# EAGLE design puck_lights (EAGLE 8.6.0)
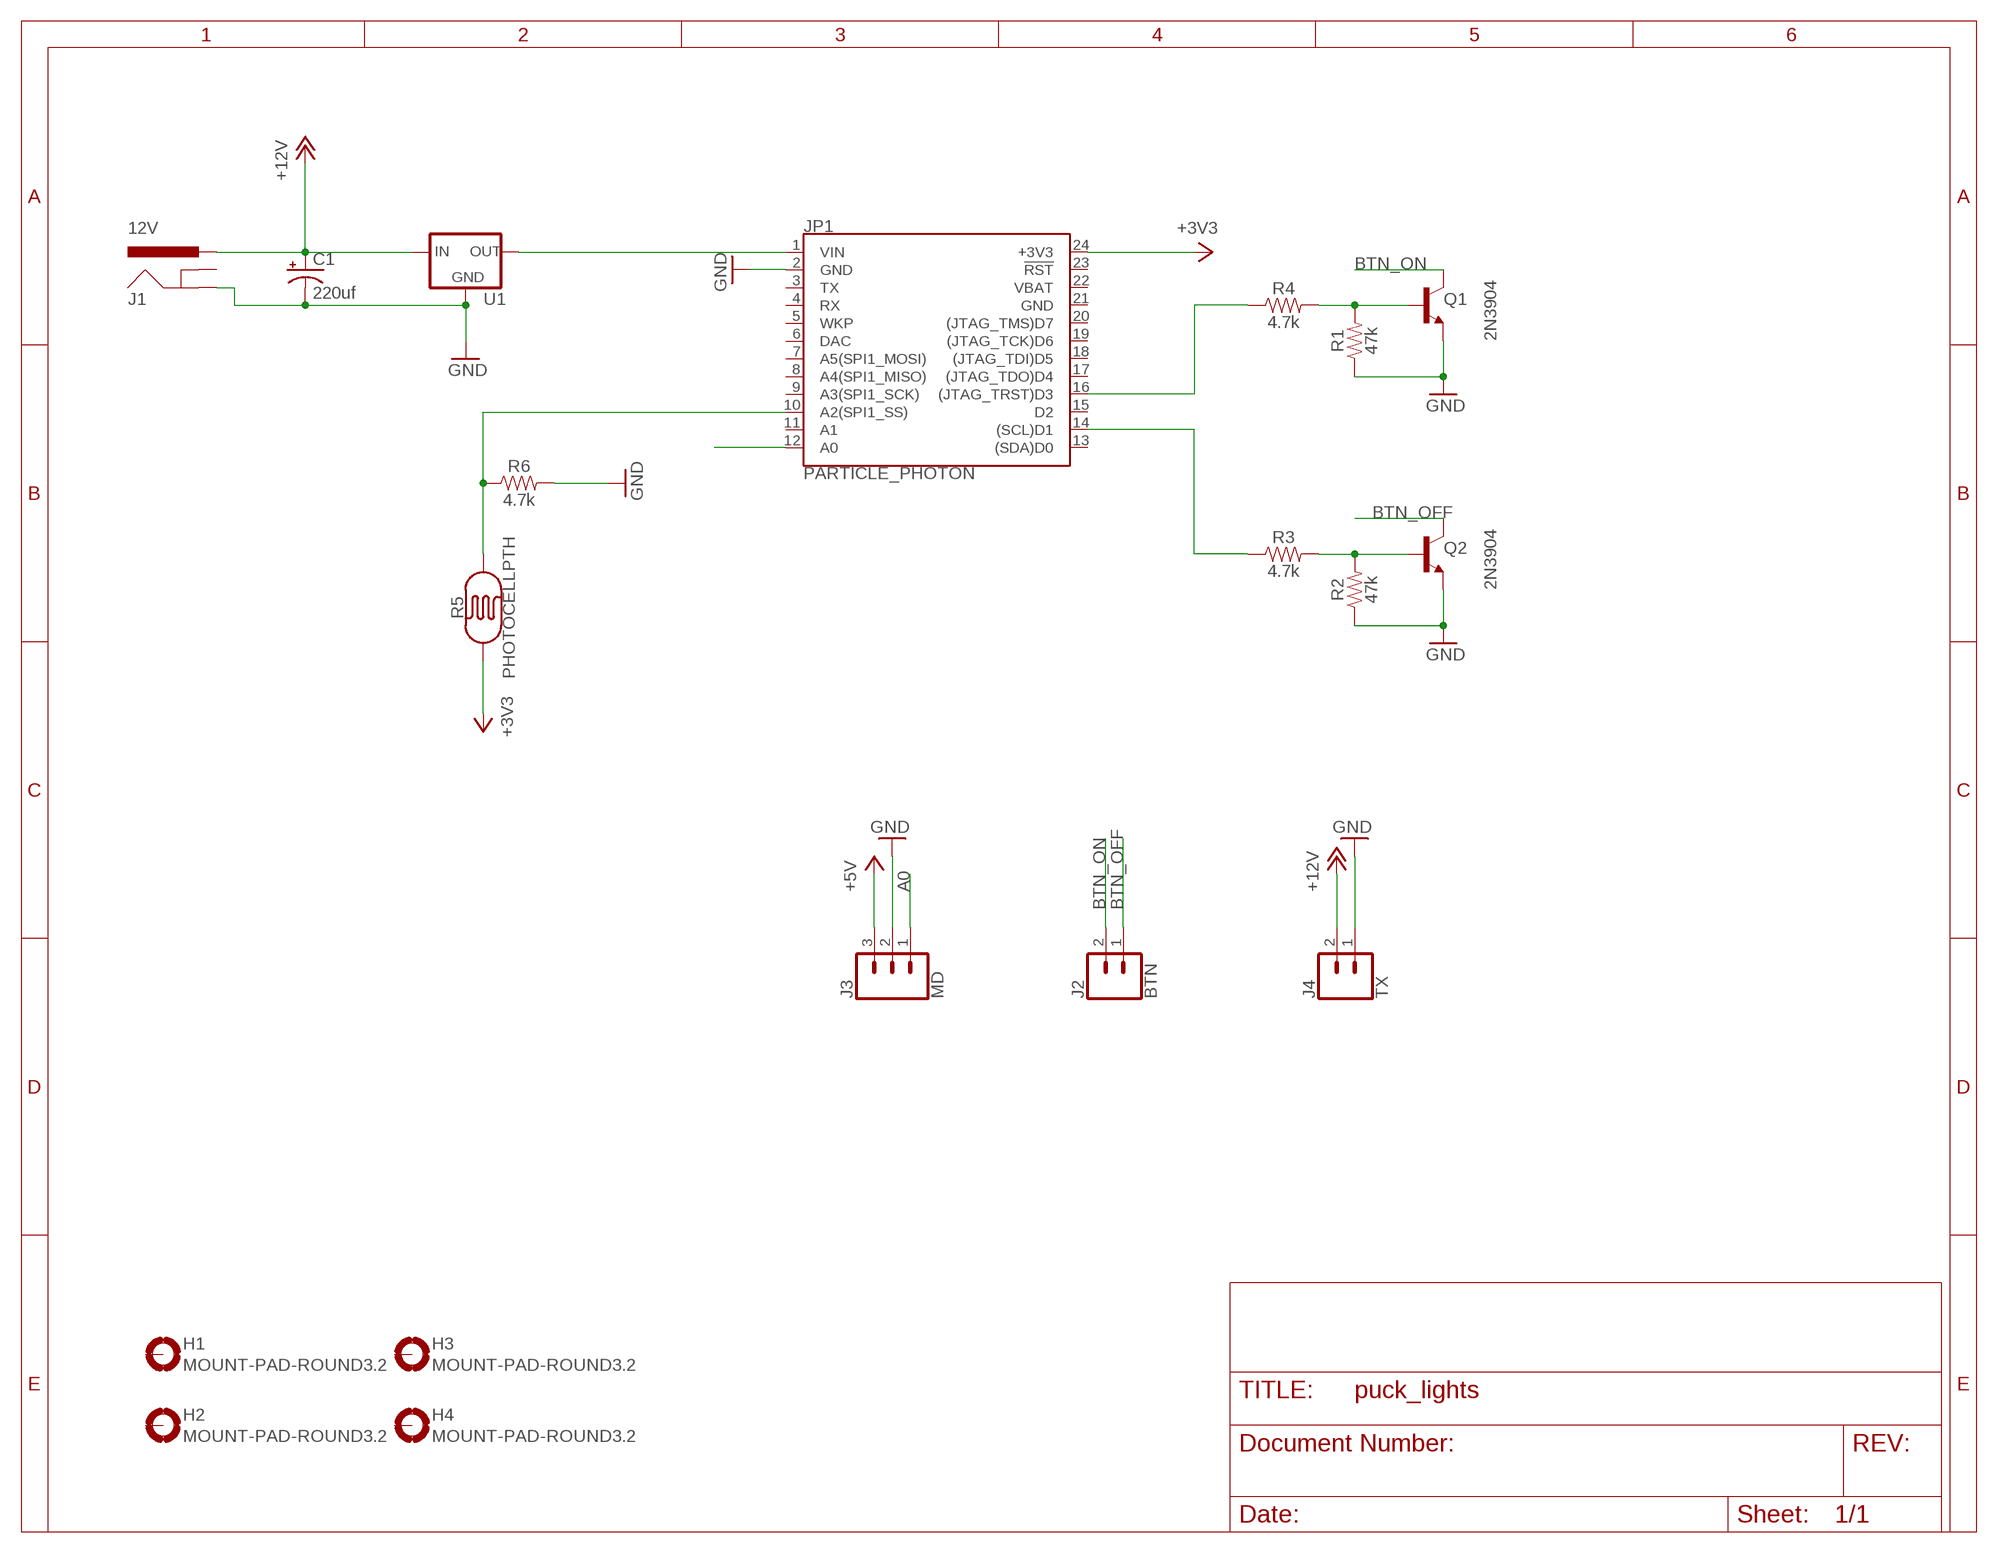
[diagram p0: schematic, sheet 1]

## Parts
C1  220uf  100UF-POLAR-RADIAL-2.5MM-25V-20%  [CPOL-RADIAL-2.5MM-6.5MM]
H1  MOUNT-PAD-ROUND3.2  [3,2-PAD]
H2  MOUNT-PAD-ROUND3.2  [3,2-PAD]
H3  MOUNT-PAD-ROUND3.2  [3,2-PAD]
H4  MOUNT-PAD-ROUND3.2  [3,2-PAD]
J1  12V  POWER_JACKSMD  [POWER_JACK_SMD]
J2  BTN  CONN_02  [1X02]
J3  MD  CONN_03JST-PTH  [JST-3-PTH]
J4  TX  CONN_02  [1X02]
JP1  PARTICLE_PHOTON  [PARTICLE_PHOTON]
Q1  2N3904  [TO92]
Q2  2N3904  [TO92]
R1  47k  1KOHM-HORIZ-1/4W-5%  [AXIAL-0.3]
R2  47k  1KOHM-HORIZ-1/4W-5%  [AXIAL-0.3]
R3  4.7k  1KOHM-HORIZ-1/4W-5%  [AXIAL-0.3]
R4  4.7k  1KOHM-HORIZ-1/4W-5%  [AXIAL-0.3]
R5  PHOTOCELLPTH  [PHOTOCELL]
R6  4.7k  1KOHM-HORIZ-1/4W-5%  [AXIAL-0.3]
U1  V_REG_78XX-TO-220  [TO-220-ALT]

## Nets
+3V3: JP1.24(+3V3) R5.1
+5V: J3.3
+12V: C1.1(+) J1.VIN0(PWR) J4.2 U1.IN
A0: J3.1 JP1.12(A0)
BTN_OFF: J2.1 Q2.1(C)
BTN_ON: J2.2 Q1.1(C)
GND: C1.2(-) J1.P$4(GND) J3.2 J4.1 JP1.2(GND) Q1.3(E) Q2.3(E) R1.P$1 R2.P$1 R6.P$2 U1.GND
N$2: JP1.14((SCL)D1) R3.P$1
N$3: JP1.1(VIN) U1.OUT
N$4: JP1.16((JTAG_TRST)D3) R4.P$1
N$5: Q2.2(B) R2.P$2 R3.P$2
N$6: Q1.2(B) R1.P$2 R4.P$2
N$7: JP1.10(A2(SPI1_SS)) R5.2 R6.P$1
Unconnected: H1.B3,2(MOUNT) H2.B3,2(MOUNT) H3.B3,2(MOUNT) H4.B3,2(MOUNT) J1.GND(GNDBREAK) JP1.3(TX) JP1.4(RX) JP1.5(WKP) JP1.6(DAC) JP1.7(A5(SPI1_MOSI)) JP1.8(A4(SPI1_MISO)) JP1.9(A3(SPI1_SCK)) JP1.11(A1) JP1.13((SDA)D0) JP1.15(D2) JP1.17((JTAG_TDO)D4) JP1.18((JTAG_TDI)D5) JP1.19((JTAG_TCK)D6) JP1.20((JTAG_TMS)D7) JP1.23(!RST!)

## Power pins joined to a net without a drawn wire
GND: JP1.21(GND)
VBAT: JP1.22(VBAT)

## Library data of the parts
C1 = SparkFun-Capacitors:100UF-POLAR: 100µF polarized capacitors A capacitor is a passive two-terminal electrical component used to store electrical energy temporarily in an electric field.; PROD_ID: CAP-08439; VALUE: 100uF
H1-H4 = holes:MOUNT-PAD-ROUND: MOUNTING PAD, round
J1 = SparkFun-Connectors:POWER_JACK: Power Jack Connector This is the standard 5.5mm barrel jack for power. The PTH is the most common, proven, reliable, footprint. The Slot footprint only works if the mill layer is transmitted to the PCB fab house so be warned. Here are the connectors we sell at SparkFun: DC Barrel Power Jack/Connector <https://www.sparkfun.com/products/119> (PRT-00119) DC Barrel Power Jack/Connector (SMD) <https://www.sparkfun.com/products/12748> (PRT-12748) DC Barrel Jack Adapter - Breadboard Compatible <https://www.sparkfun.com/products/10811> (PRT-10811) It is used on this SparkFun product (and many, many others): SparkFun RedBoard - Programmed with Arduino <https://www.sparkfun.com/products/12757> (DEV-12757) Also, if you need a mating power supply or connector, please check these out: Wall Adapter Power Supply - 9VDC 650mA <https://www.sparkfun.com/products/298> (TOL-00298) DC Barrel Jack Adapter - Male <https://www.sparkfun.com/products/10287> (PRT-10287); PROD_ID: CONN-08106; SF_ID: PRT-12748; VALUE: 5.5x2.1mm Barrel
J2 J4 = SparkFun-Connectors:CONN_02: Multi connection point. Often used as Generic Header-pin footprint for 0.1 inch spaced/style header connections On any of the 0.1 inch spaced packages, you can populate with these: Break Away Headers - Straight <https://www.sparkfun.com/products/116> (PRT-00116) Break Away Male Headers - Right Angle <https://www.sparkfun.com/products/553> (PRT-00553) Female Headers <https://www.sparkfun.com/products/115> (PRT-00115) Break Away Headers - Machine Pin <https://www.sparkfun.com/products/117> (PRT-00117) Break Away Female Headers - Swiss Machine Pin <https://www.sparkfun.com/products/743> (PRT-00743) For SCREWTERMINALS and SPRING TERMINALS visit here: Screw Terimnals on SparkFun.com <https://www.sparkfun.com/search/results?term=Screw+Terminals> (5mm/3.5mm/2.54mm spacing) This device is also useful as a general connection point to wire up your design to another part of your project. Our various solder wires solder well into these plated through hole pads. Hook-Up Wire - Assortment (Stranded, 22 AWG) <https://www.sparkfun.com/products/11375> (PRT-11375) Hook-Up Wire - Assortment (Solid Core, 22 AWG) <https://www.sparkfun.com/products/11367> (PRT-11367) View the entire wire category on our website here <https://www.sparkfun.com/categories/141> Special notes: Molex polarized connector foot print use with: PRT-08233 with associated crimp pins and housings. 2.54_SCREWTERM for use with PRT-10571. 3.5mm Screw Terminal footprints for PRT-08084 5mm Screw Terminal footprints for use with PRT-08432
J3 = SparkFun-Connectors:CONN_03: Multi connection point. Often used as Generic Header-pin footprint for 0.1 inch spaced/style header connections On any of the 0.1 inch spaced packages, you can populate with these: Break Away Headers - Straight <https://www.sparkfun.com/products/116> (PRT-00116) Break Away Male Headers - Right Angle <https://www.sparkfun.com/products/553> (PRT-00553) Female Headers <https://www.sparkfun.com/products/115> (PRT-00115) Break Away Headers - Machine Pin <https://www.sparkfun.com/products/117> (PRT-00117) Break Away Female Headers - Swiss Machine Pin <https://www.sparkfun.com/products/743> (PRT-00743) Stackable Header - 3 Pin (Female, 0.1") <https://www.sparkfun.com/products/13875> (PRT-13875) For SCREWTERMINALS and SPRING TERMINALS visit here: Screw Terimnals on SparkFun.com <https://www.sparkfun.com/search/results?term=Screw+Terminals> (5mm/3.5mm/2.54mm spacing) This device is also useful as a general connection point to wire up your design to another part of your project. Our various solder wires solder well into these plated through hole pads. Hook-Up Wire - Assortment (Stranded, 22 AWG) <https://www.sparkfun.com/products/11375> (PRT-11375) Hook-Up Wire - Assortment (Solid Core, 22 AWG) <https://www.sparkfun.com/products/11367> (PRT-11367) View the entire wire category on our website here <https://www.sparkfun.com/categories/141> Special notes: Molex polarized connector foot print use with SKU : PRT-08232 with associated crimp pins and housings.; PROD_ID: WIRE-10037; SF_ID: PRT-09915
JP1 = SparkFun-Boards:PARTICLE_PHOTON: Particle Photon Footprint of the Particle Photon that is used as a basis for many Photon shields. SparkFun Products: Particle Photon <https://www.sparkfun.com/products/13764> SparkFun Photon ProtoShield <https://www.sparkfun.com/products/13598> SparkFun Photon micro OLED Shield <https://www.sparkfun.com/products/13628> SparkFun Photon IMU Shield <https://www.sparkfun.com/products/13629> SparkFun Photon Battery Shield <https://www.sparkfun.com/products/13626>
Q1 Q2 = transistor-npn:2N3904: NPN Transistor
R1-R4 R6 = SparkFun-Resistors:1KOHM: 1kΩ resistor A resistor is a passive two-terminal electrical component that implements electrical resistance as a circuit element. Resistors act to reduce current flow, and, at the same time, act to lower voltage levels within circuits. - Wikipedia; PROD_ID: RES-08380; VALUE: 1k
R5 = SparkFun-Sensors:PHOTOCELL: Photocell (Photodetector, Photo Resistor, CdS) This is a very small light sensor. A photocell changes (also called a photodetector, photo resistor, CdS or photoconductive cell) resistance depending on the amount of light it is exposed to. These little sensors make great ambient light triggers (when light in the room turns on, do something). Datasheet <http://cdn.sparkfun.com/datasheets/Sensors/LightImaging/SEN-09088.pdf> SparkFun Products Mini Photocell <https://www.sparkfun.com/products/9088> (SEN-09088); PROD_ID: COMP-09129; SF_ID: SEN-09088
U1 = SparkFun-IC-Power:V_REG_78XX: Voltage Regulator Standard 78xx regulator. IGO (Input Ground Output). Spark Fun Electronics SKU : COM-00107; PROD_ID: VREG-08450; SF_ID: COM-00107

## Board
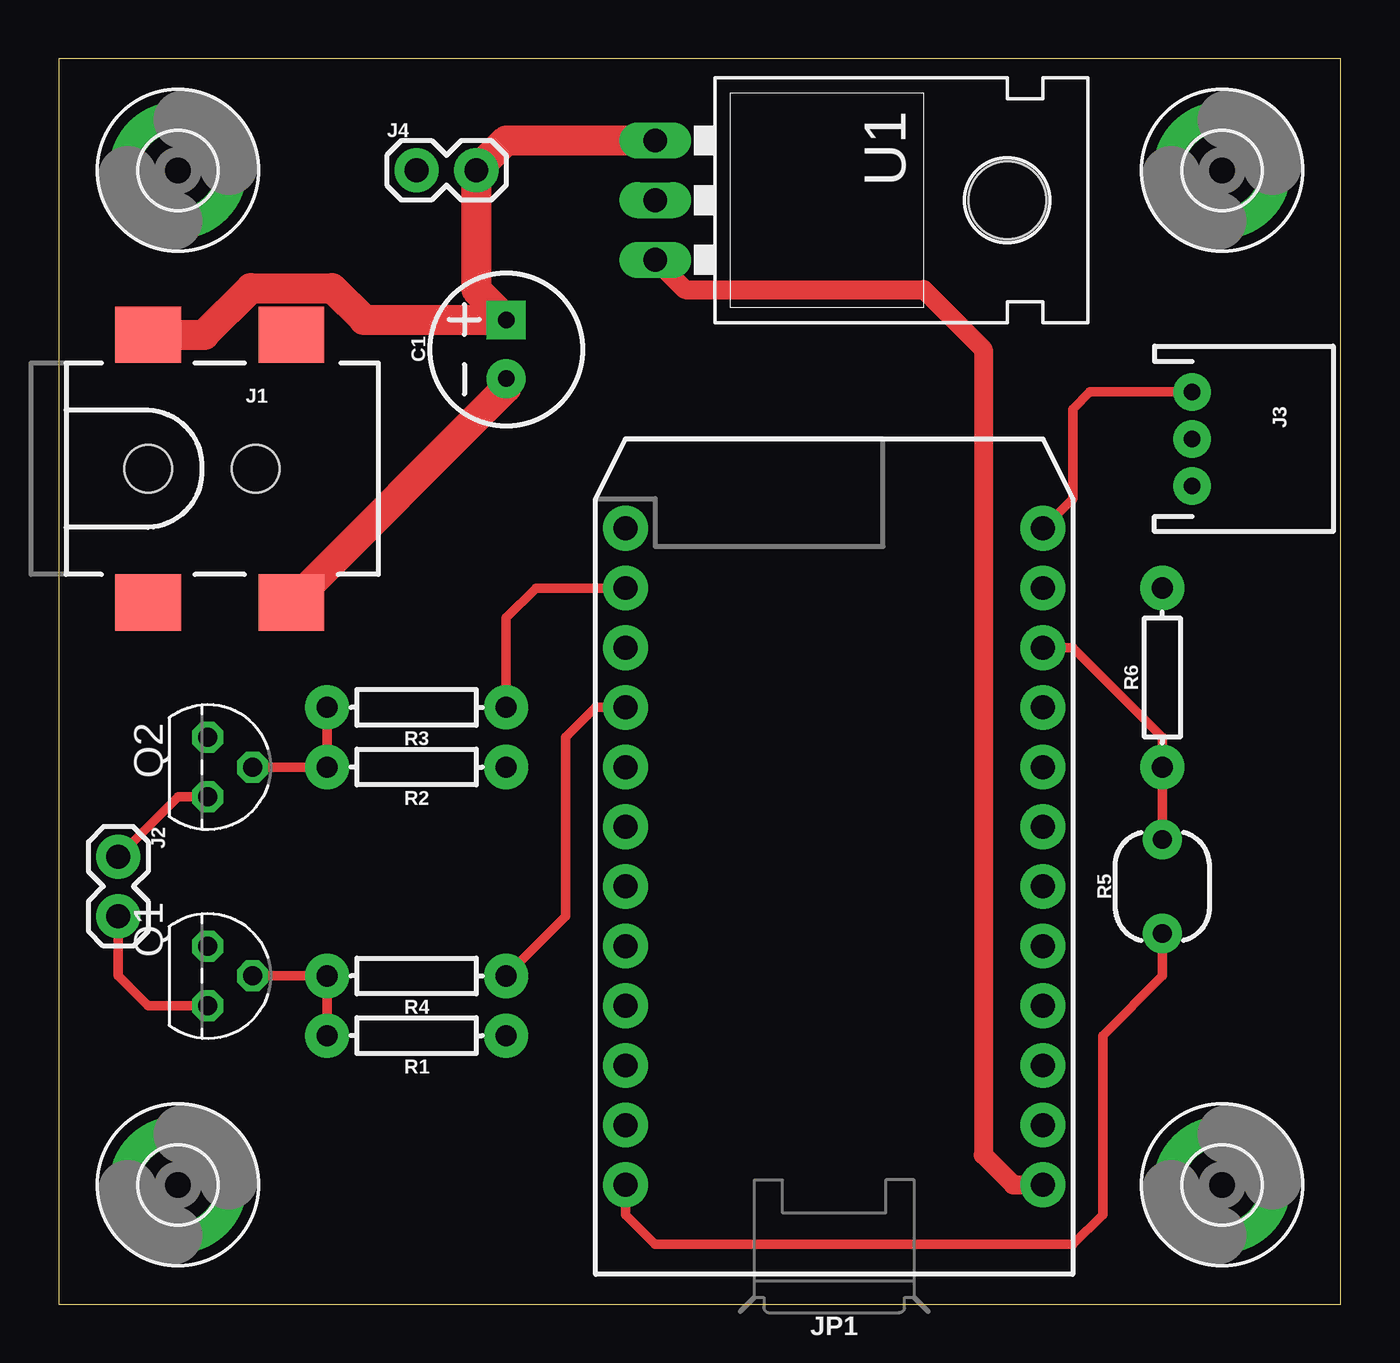
[diagram p1: board, top side]
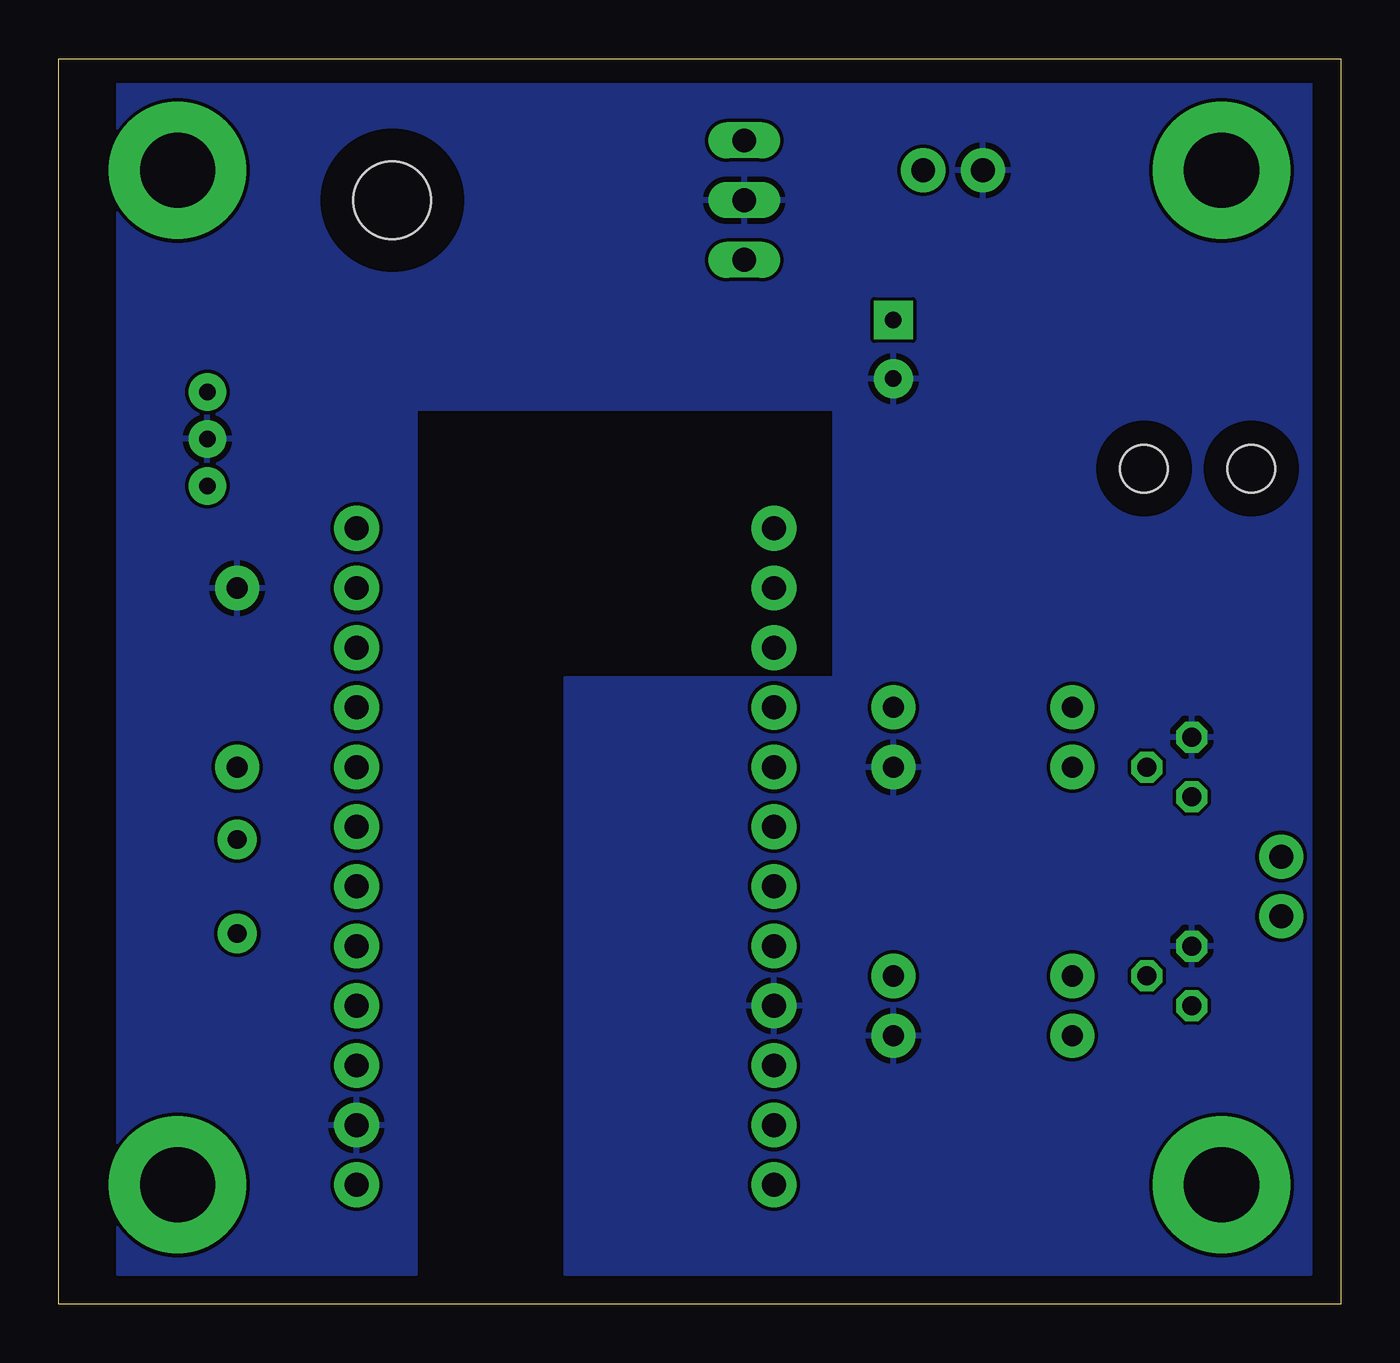
[diagram p2: board, bottom side, seen from below]

Size 54.59 x 53.01 mm. Coordinates in mm from the lower left corner, seen from the top.
Outline: 0,0 54.59,0 54.59,53.01 0,53.01 0,0
Copper layers (1*16): Top 0.035mm / dielectric 1.5mm / Bottom 0.035mm
Design rules "default": minimum track width 6mil, minimum drill 0.35mm, track to track 6mil, track to pad 6mil, pad to pad 6mil, via to via 6mil, smd to smd 6mil, copper to edge 40mil, drill to drill 6mil, minimum pad ring 10mil, minimum via ring 8mil, stop-mask expansion 4mil, vias tented up to drill 0mil, thermal gap 10mil

### Footprints (pad centres in the part's own frame; a part is rotated, then mirrored left to right if it is on the bottom)
CPOL-RADIAL-2.5MM-6.5MM = drill 0.7 pad 1.651 square: 1 1.25,0 | drill 0.7 pad 1.651: 2 -1.25,0
3,2-PAD = drill 3.2 pad 5.842: B3,2 0,0
POWER_JACK_SMD = smd 2.8 x 2.4: GND 0,-5.7; P$4 6.1,-5.7; VIN0 0,5.7; VIN1 6.1,5.7 | hole 2.032: 0,0; 4.572,0
1X02 = drill 1.016 pad 1.88: 1 0,0; 2 2.54,0
JST-3-PTH = drill 0.7 pad 1.6: 1 -2,0; 2 0,0; 3 2,0
PARTICLE_PHOTON = drill 1.016 pad 1.905: 1 -8.89,13.97; 2 -8.89,11.43; 3 -8.89,8.89; 4 -8.89,6.35; 5 -8.89,3.81; 6 -8.89,1.27; 7 -8.89,-1.27; 8 -8.89,-3.81; 9 -8.89,-6.35; 10 -8.89,-8.89; 11 -8.89,-11.43; 12 -8.89,-13.97; 13 8.89,-13.97; 14 8.89,-11.43; 15 8.89,-8.89; 16 8.89,-6.35; 17 8.89,-3.81; 18 8.89,-1.27; 19 8.89,1.27; 20 8.89,3.81; 21 8.89,6.35; 22 8.89,8.89; 23 8.89,11.43; 24 8.89,13.97
TO92 = drill 0.813 octagon: 1 1.27,0; 2 0,1.905; 3 -1.27,0
AXIAL-0.3 = drill 0.9 pad 1.88: P$1 -3.81,0; P$2 3.81,0
PHOTOCELL = drill 0.8 pad 1.676: 1 -2,0; 2 2,0
TO-220-ALT = drill 1.016 long: GND 0,-3.81; IN -2.54,-3.81; OUT 2.54,-3.81 | hole 3.302: 0,11.176

### Placement (x,y rotation side)
C1  19.05,40.64 90 top
H1  5.08,5.08 0 top
H2  5.08,48.26 0 top
H3  49.53,5.08 0 top
H4  49.53,48.26 0 top
J1  3.81,35.56 0 top
J2  2.54,19.05 270 top
J3  48.26,36.83 270 top
J4  15.24,48.26 0 top
JP1  33.02,19.05 180 top
Q1  6.35,13.97 270 top
Q2  6.35,22.86 270 top
R1  15.24,11.43 180 top
R2  15.24,22.86 180 top
R3  15.24,25.4 180 top
R4  15.24,13.97 180 top
R5  46.99,17.78 90 top
R6  46.99,26.67 90 top
U1  29.21,46.99 270 top

### Tracks (layer width: path | path; a pad name or v marks a point on that pad's centre or on a via)
+3V3
  Top 0.406: R5.1 46.99,13.97 44.45,11.43 44.45,3.81 43.18,2.54 25.4,2.54 24.13,3.81 JP1.24
+12V
  Top 1.27: J1.VIN0 6.2,41.26 8.18,43.25 11.64,43.25 12.99,41.89 C1.1 19.05,41.91 17.78,43.18 J4.2 19.05,49.53 U1.IN
A0
  Top 0.406: JP1.12 43.18,34.29 43.18,38.1 43.91,38.83 J3.1
BTN_OFF
  Top 0.406: J2.1 5.08,21.59 Q2.1
BTN_ON
  Top 0.406: Q1.1 3.81,12.7 2.54,13.97 J2.2
GND
  Top 1.27: J1.P$4 19.05,39 C1.2
  pour Bottom: 52.07,52.07 52.07,1.27 39.37,1.27 39.37,38.1 21.59,38.1 21.59,26.67 33.02,26.67 33.02,1.27 1.27,1.27 1.27,52.07
N$2
  Top 0.406: JP1.14 20.32,30.48 19.05,29.21 R3.P$1
N$3
  Top 0.813: U1.OUT 26.67,43.18 36.83,43.18 39.37,40.64 39.37,6.35 40.64,5.08 JP1.1
N$4
  Top 0.406: R4.P$1 21.59,16.51 21.59,24.13 22.86,25.4 JP1.16
N$5
  Top 0.406: R3.P$2 R2.P$2 Q2.2
N$6
  Top 0.406: Q1.2 R4.P$2 R1.P$2
N$7
  Top 0.406: JP1.10 43.18,27.94 46.99,24.13 R6.P$1 R5.2